# EAGLE design messverstaerker-opamp-proto (EAGLE 9.6.0)
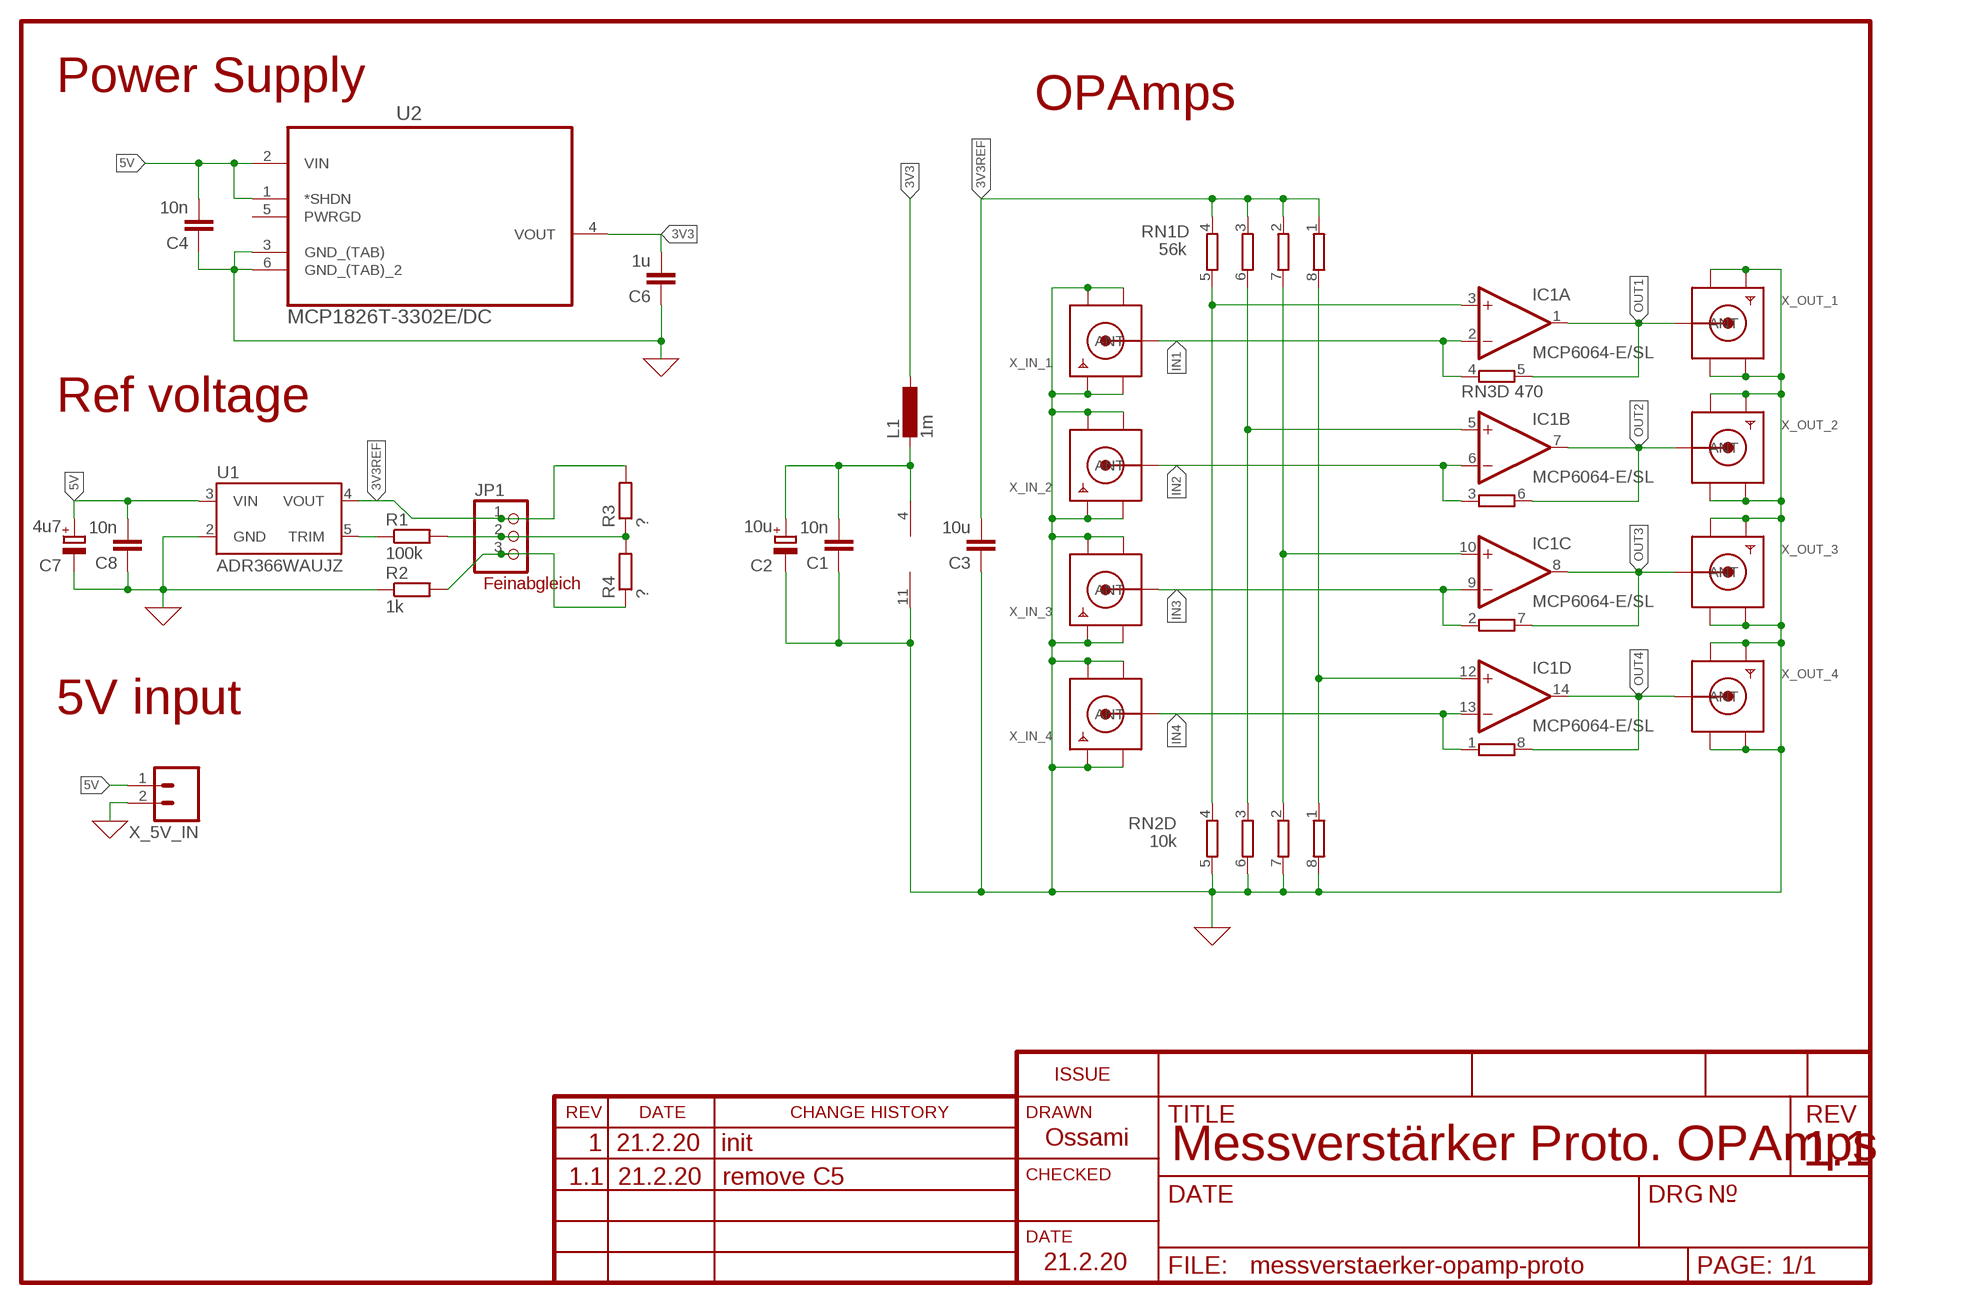
[diagram p0: schematic, sheet 1]

## Parts
C1  10n  C-EUC0805  [C0805]
C2  10u  CPOL-EU153CLV-0810  [153CLV-0810]
C3  10u  C-EUC0805  [C0805]
C4  10n  C-EUC0805  [C0805]
C6  1u  C-EUC0805  [C0805]
C7  4u7  CPOL-EU153CLV-0810  [153CLV-0810]
C8  10n  C-EUC0805  [C0805]
IC1  MCP6064-E/SL  MCP604SL  [SO14]
JP1  PINHD-1X3  [1X03]
L1  1m  L-EUL5650M  [L5650M]
R1  100k  R-EU_R0805  [R0805]
R2  1k  R-EU_R0805  [R0805]
R3  ?  R-EU_R0805  [R0805]
R4  ?  R-EU_R0805  [R0805]
RN1  56k  4R-NEXBS8V  [EXBS8V]
RN2  10k  4R-NEXBS8V  [EXBS8V]
RN3  470  4R-NEXBS8V  [EXBS8V]
U1  ADR366WAUJZ  ADR36_UJZ  [SOT23-5]
U2  MCP1826T-3302E/DC  MCP1826T-3002E/DC  [SOT230P700X180-6N]
X_5V_IN  M02LOCK  [1X02_LOCK]
X_IN_1  SMACONNECTOR_EDGE  [SMA_EDGELAUNCH]
X_IN_2  SMACONNECTOR_EDGE  [SMA_EDGELAUNCH]
X_IN_3  SMACONNECTOR_EDGE  [SMA_EDGELAUNCH]
X_IN_4  SMACONNECTOR_EDGE  [SMA_EDGELAUNCH]
X_OUT_1  SMACONNECTOR_EDGE  [SMA_EDGELAUNCH]
X_OUT_2  SMACONNECTOR_EDGE  [SMA_EDGELAUNCH]
X_OUT_3  SMACONNECTOR_EDGE  [SMA_EDGELAUNCH]
X_OUT_4  SMACONNECTOR_EDGE  [SMA_EDGELAUNCH]

## Nets
0: C1.1 C2.- C3.1 C4.1 C6.1 C7.- C8.1 IC1.11(P:V-) R2.1 RN2.5 RN2.6 RN2.7 RN2.8 U1.2(GND) U2.3(GND_(TAB)) U2.6(GND_(TAB)_2) X_5V_IN.2 X_IN_1.GND@1(GND4) X_IN_1.GND@2(GND3) X_IN_1.GND@3(GND2) X_IN_1.GND@4(GND1) X_IN_2.GND@1(GND4) X_IN_2.GND@2(GND3) X_IN_2.GND@3(GND2) X_IN_2.GND@4(GND1) X_IN_3.GND@1(GND4) X_IN_3.GND@2(GND3) X_IN_3.GND@3(GND2) X_IN_3.GND@4(GND1) X_IN_4.GND@1(GND4) X_IN_4.GND@2(GND3) X_IN_4.GND@3(GND2) X_IN_4.GND@4(GND1) X_OUT_1.GND@1(GND4) X_OUT_1.GND@2(GND3) X_OUT_1.GND@3(GND2) X_OUT_1.GND@4(GND1) X_OUT_2.GND@1(GND4) X_OUT_2.GND@2(GND3) X_OUT_2.GND@3(GND2) X_OUT_2.GND@4(GND1) X_OUT_3.GND@1(GND4) X_OUT_3.GND@2(GND3) X_OUT_3.GND@3(GND2) X_OUT_3.GND@4(GND1) X_OUT_4.GND@1(GND4) X_OUT_4.GND@2(GND3) X_OUT_4.GND@3(GND2) X_OUT_4.GND@4(GND1) ; supply symbol labelled GND
3V3: C6.2 L1.1 U2.4(VOUT)
3V3REF: C3.2 JP1.1 R3.2 RN1.1 RN1.2 RN1.3 RN1.4 U1.4(VOUT)
5V: C4.2 C7.+ C8.2 U1.3(VIN) U2.1(*SHDN) U2.2(VIN) X_5V_IN.1
IN1: IC1.2(A:-IN) RN3.4 X_IN_1.P(ANT)
IN2: IC1.6(B:-IN) RN3.3 X_IN_2.P(ANT)
IN3: IC1.9(C:-IN) RN3.2 X_IN_3.P(ANT)
IN4: IC1.13(D:-IN) RN3.1 X_IN_4.P(ANT)
N$1: IC1.3(A:+IN) RN1.5 RN2.4
N$2: IC1.5(B:+IN) RN1.6 RN2.3
N$3: IC1.10(C:+IN) RN1.7 RN2.2
N$4: IC1.12(D:+IN) RN1.8 RN2.1
N$5: R1.1 U1.5(TRIM)
N$6: C1.2 C2.+ IC1.4(P:V+) L1.2
N$8: JP1.2 R1.2 R3.1 R4.2
N$10: JP1.3 R2.2 R4.1
OUT1: IC1.1(A:OUT) RN3.5 X_OUT_1.P(ANT)
OUT2: IC1.7(B:OUT) RN3.6 X_OUT_2.P(ANT)
OUT3: IC1.8(C:OUT) RN3.7 X_OUT_3.P(ANT)
OUT4: IC1.14(D:OUT) RN3.8 X_OUT_4.P(ANT)
Unconnected: U2.5(PWRGD)

## Notes on the sheet
- Power Supply
- OPAmps
- Ref voltage
- Feinabgleich
- 5V input
- 1  21.2.20   init | Ossami
- Messverstärker Proto. OPAmps | 1.1
- 1.1  21.2.20   remove C5
- 21.2.20

## Library data of the parts
C1 C3 C4 C6 C8 = rcl:C-EU: CAPACITOR, European symbol; SPICEPREFIX: C
C2 C7 = rcl:CPOL-EU: POLARIZED CAPACITOR, European symbol; SPICEPREFIX: C
IC1 = linear:MCP604: Quad Op Amp 2.7V to 6.0V Single Supply CMOS Source: http://ww1.microchip.com/downloads/en/DeviceDoc/21314g.pdf
JP1 = adafruit:PINHD-1X3: PIN HEADER
L1 = rcl:L-EU: INDUCTOR, European symbol; SPICEPREFIX: L
R1-R4 = rcl:R-EU_: RESISTOR, European symbol; SPICEPREFIX: R
RN1-RN3 = resistor-dil:4R-N: Array Chip Resistor Source: RS Component / Phycomp; OC_FARNELL: unknown; OC_NEWARK: unknown
U1 = ADR360:ADR36*: ADR360 (ADR360 ADR361 ADR363 ADR364 ADR365 ADR366 A|B UJZ) 5-Lead TSOT Low Power, Low Noise, Band Gap Voltage References Analog Devices Source: www.analog.com Technologies / Packages ADR36n A|B UJZ n Output-Voltage: 0 = 2.048V | 1 = 2.500 V | 3 = 3.000 V | 4 = 4.096 V | 5 = 5.000 V | 6 = 3.300 V A|B Grade: A = 25 ppm/K; +-6 mV max. | B = 9 ppm/K; +- 3mV max. UJZ Package: 5-Lead TSOT, RoHS-compliant Vin = 15 (18) V, Vdrop = 300 mV, Iout = +5 mA / -1mA Author: Dipl.-Ing. FH Rainer Bayer HHN Hochschule Heilbronn, rainer.bayer@hs-heilbronn.de Ingenieurbüro ing-rb, mail@ing-rb.de
U2 = MCP1826T-3002E_DC:MCP1826T-3002E/DC: IC, LDO VOLT REG, 3V, 1A; AVAILABILITY: Good; DESCRIPTION: Ic, Linear Regulator; Max. Input, 6v; Output, 3v; 1000ma; Accuracy, 0.5%; Sot223-5; MF: Microchip; MP: MCP1826T-3002E/DC; PACKAGE: SOT-223 Microchip; PRICE: 0.59 USD
X_5V_IN = aSparkFun:M02: Header 2 Standard 2-pin 0.1" header. Use with straight break away headers (SKU : PRT-00116), right angle break away headers (PRT-00553), swiss pins (PRT-00743), machine pins (PRT-00117), and female headers (PRT-00115). Molex polarized connector foot print use with SKU : PRT-08233 with associated crimp pins and housings.
X_IN_1-X_IN_4 X_OUT_1-X_OUT_4 = adafruit:SMACONNECTOR: SMA Connector 90° DIP SMA Connector, 50 Ohm (4UConnector: 07259)

## Board
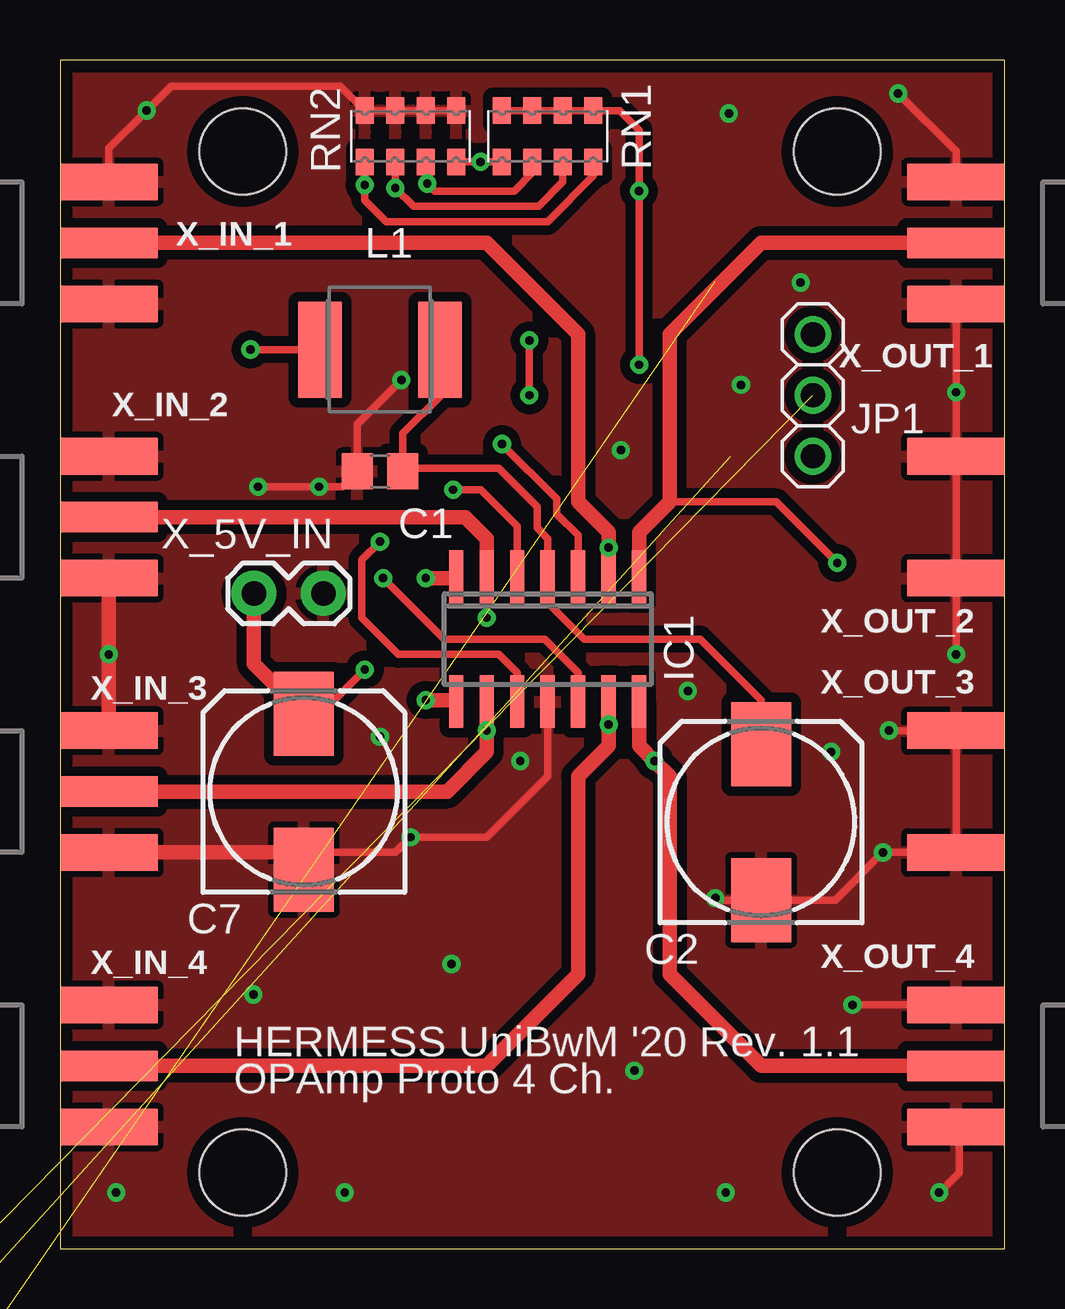
[diagram p1: board, top side]
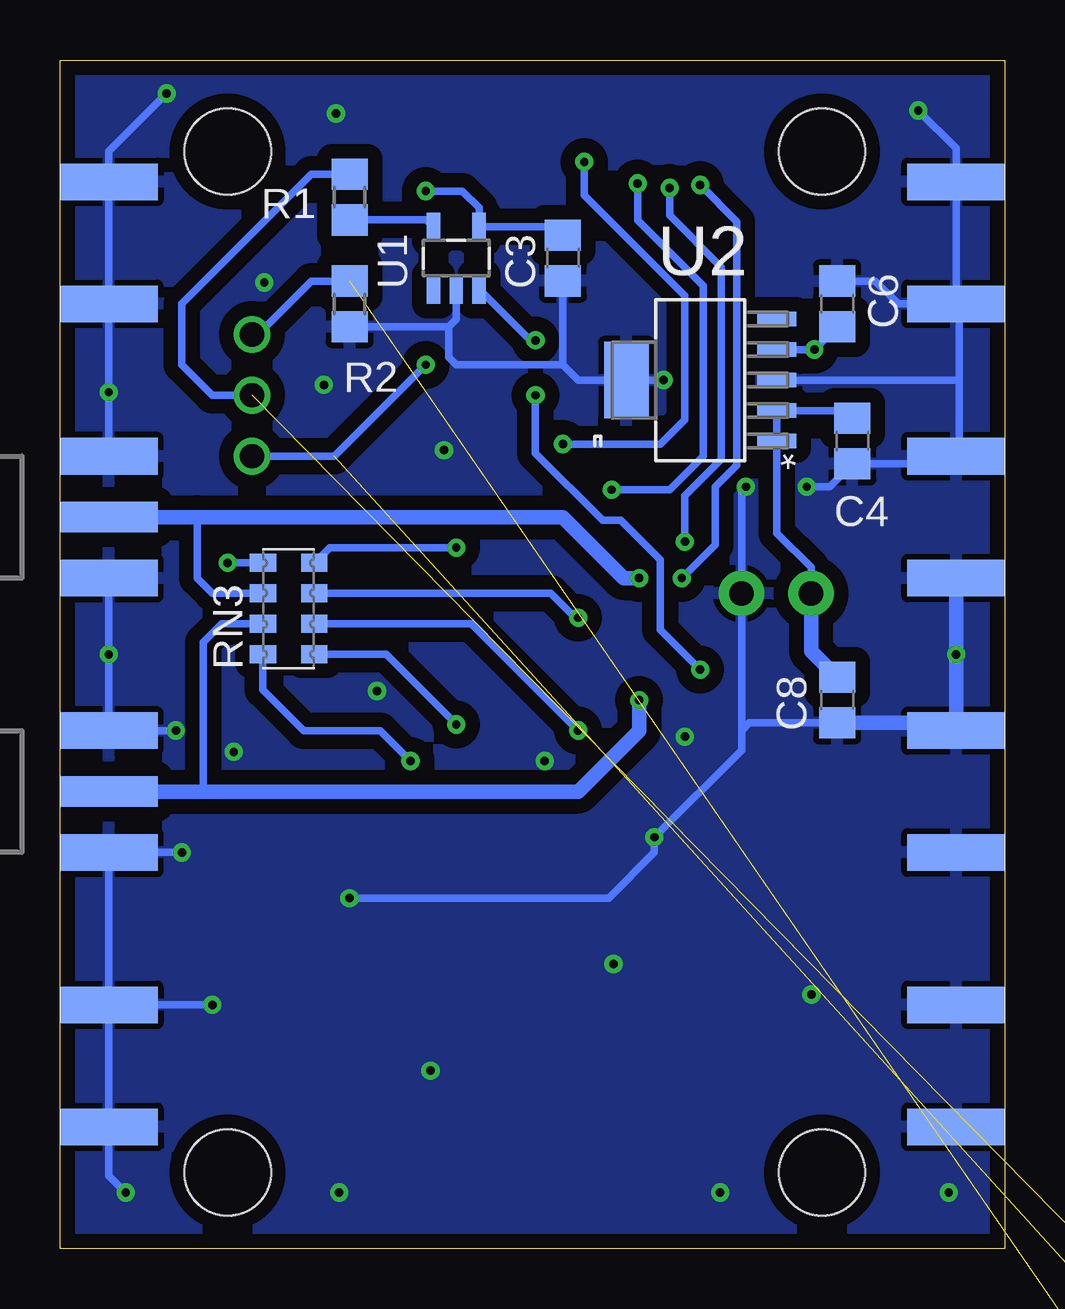
[diagram p2: board, bottom side, seen from below]

Size 39.37 x 49.53 mm. Coordinates in mm from the lower left corner, seen from the top.
Outline: 0,0 39.37,0 39.37,49.53 0,49.53 0,0
Copper layers (1*16): Top 0.035mm / dielectric 1.5mm / Bottom 0.035mm
Design rules "default *": minimum track width 12mil, minimum drill 0.35mm, track to track 12mil, track to pad 12mil, pad to pad 12mil, via to via 12mil, smd to smd 6mil, copper to edge 20mil, drill to drill 6mil, minimum pad ring 10mil, minimum via ring 8mil, stop-mask expansion 4mil, vias tented up to drill 0mil, thermal gap 10mil
Holes 3.6 mm at 32.38,45.72 7.62,45.72 7.62,3.18 32.38,3.18

### Footprints (pad centres in the part's own frame; a part is rotated, then mirrored left to right if it is on the bottom)
C0805 = smd 1.3 x 1.5: 1 -0.95,0; 2 0.95,0
153CLV-0810 = smd 3.5 x 2.5: + 3.25,0; - -3.25,0
SO14 = smd 0.6 x 2.2: 1 -3.81,-2.6; 2 -2.54,-2.6; 3 -1.27,-2.6; 4 0,-2.6; 5 1.27,-2.6; 6 2.54,-2.6; 7 3.81,-2.6; 8 3.81,2.6; 9 2.54,2.6; 10 1.27,2.6; 11 0,2.6; 12 -1.27,2.6; 13 -2.54,2.6; 14 -3.81,2.6
1X03 = drill 1.016: 1 -2.54,0; 2 0,0; 3 2.54,0
L5650M = smd 1.8 x 4: 1 -2.5,0; 2 2.5,0
R0805 = smd 1.3 x 1.5: 1 -0.95,0; 2 0.95,0
EXBS8V = smd 0.75 x 1.1: 1 -1.905,-1.07; 2 -0.635,-1.07; 3 0.635,-1.07; 4 1.905,-1.07; 5 1.905,1.07; 6 0.635,1.07; 7 -0.635,1.07; 8 -1.905,1.07
SOT23-5 = smd 0.55 x 1.2: 1 -0.95,-1.3; 2 0,-1.3; 3 0.95,-1.3; 4 0.95,1.3; 5 -0.95,1.3
SOT230P700X180-6N = smd 1.626 x 0.61: 1 -3.2,2.54; 2 -3.2,1.27; 3 -3.2,0; 4 -3.2,-1.27; 5 -3.2,-2.54 | smd 1.854 x 3.175: 6 3.073,0
1X02_LOCK = drill 1.016 pad 1.88: 1 -0.178,0; 2 2.718,0
SMA_EDGELAUNCH = smd 4.064 x 1.524: GND@1 2.032,-2.54; GND@2 2.032,2.54 | smd 4.064 x 1.524 bottom: GND@3 2.032,2.54; GND@4 2.032,-2.54 | smd 4.064 x 1.27: P 2.032,0

### Placement (x,y rotation side)
C1  13.34,32.39 0 top
C2  29.21,17.78 90 top
C3  18.41,41.28 90 bottom
C4  6.35,33.66 90 bottom
C6  6.99,39.37 270 bottom
C7  10.16,19.05 90 top
C8  6.99,22.86 90 bottom
IC1  20.32,25.4 180 top
JP1  31.37,35.56 90 top
L1  13.34,37.47 0 top
R1  27.3,43.81 90 bottom
R2  27.3,39.37 90 bottom
R3  -6.99,-4.45 0 top  (outside the outline)
R4  -6.99,-10.79 0 top  (outside the outline)
RN1  20.32,46.36 180 top
RN2  14.61,46.36 0 top
RN3  29.84,26.67 90 bottom
U1  22.86,41.28 0 bottom
U2  12.7,36.19 180 bottom
X_5V_IN  8.26,27.31 0 top
X_IN_1  0,41.91 0 top
X_IN_2  0,30.48 0 top
X_IN_3  0,19.05 0 top
X_IN_4  0,7.62 0 top
X_OUT_1  39.37,41.91 180 top
X_OUT_2  39.37,30.48 0 bottom
X_OUT_3  39.37,19.05 0 bottom
X_OUT_4  39.37,7.62 180 top

### Tracks (layer width: path | path; a pad name or v marks a point on that pad's centre or on a via)
0  (via drill 0.35)
  Top 0.305: v8.26,31.75 v10.79,31.75 11.75,31.75 C1.1 12.38,34.36 v14.22,36.19 | RN2.5 RN2.6 RN2.7 RN2.8 11.68,48.44 4.63,48.44 v3.61,47.42 2.03,45.85 X_IN_1.GND@2 | IC1.11 20.32,19.68 17.78,17.14 v14.61,17.14 13.97,16.51 10.87,16.51 C7.- | v27.3,14.61 27.38,14.53 C2.- 32.31,14.53 v34.29,16.51 X_OUT_3.GND@1 X_OUT_3.GND@2 v34.54,21.59 | X_OUT_4.GND@4 v33.02,10.16 | v37.34,24.76 X_OUT_2.GND@1 X_OUT_2.GND@2 v37.34,35.69 X_OUT_1.GND@2 | X_OUT_1.GND@1 37.34,45.72 v34.92,48.13 v34.92,48.14 | v36.63,2.34 37.47,3.18 37.47,4.95 X_OUT_4.GND@3
  Top 0.61: C7.- 9.45,16.51 X_IN_3.GND@1 | X_IN_2.GND@4 v2.03,24.76 X_IN_3.GND@2
  Bottom 0.305: U1.2 22.86,38.73 23.18,38.42 | 23.18,38.42 R2.1 | C3.1 18.41,36.83 | 18.41,36.83 17.78,36.19 U2.6 v14.22,36.19 | 18.41,36.83 22.86,36.83 23.18,37.14 23.18,38.42 | C6.1 5.39,40.32 4.45,39.37 X_IN_1.GND@1 | v8.26,31.75 7.3,31.75 C4.1 2.35,32.7 X_IN_2.GND@3 1.91,33.15 1.91,36.19 | 1.91,36.19 1.91,39.24 X_IN_1.GND@1 | U2.3 1.91,36.19 | X_IN_1.GND@1 X_IN_1.GND@2 2.03,45.85 v3.61,47.42 | 10.97,21.59 X_5V_IN.2 10.97,31.57 v10.79,31.75 | 10.97,21.59 10.97,20.78 v14.61,17.14 14.61,16.51 16.51,14.61 v27.3,14.61 | X_OUT_2.GND@2 v37.34,35.69 X_OUT_1.GND@2 X_OUT_1.GND@1 37.34,45.72 v34.92,48.14 | X_OUT_2.GND@1 v37.34,24.76 X_OUT_3.GND@2 v34.54,21.59 | X_OUT_4.GND@4 X_OUT_3.GND@1 v34.29,16.51 | X_OUT_4.GND@4 X_OUT_4.GND@3 37.34,3.05 v36.63,2.34 | v33.02,10.16 X_OUT_4.GND@4 | C8.1 10.65,21.91 10.97,21.59
  Bottom 0.61: C8.1 2.35,21.91 X_IN_3.GND@2 v2.03,24.76 X_IN_2.GND@4
  other vias: 30.86,40.26 26.16,23.24 19.18,20.32 32.13,20.7 23.37,33.27 13.34,21.34 27.87,47.3 28.38,36 8.05,10.59 16.31,11.86 23.93,7.42 2.34,2.34 27.74,2.34 11.87,2.34
  pour Bottom (isolate 0.61): -0.64,-0.63 40.01,-0.63 40.01,50.17 -0.64,50.17
  pour Top (isolate 0.406): 40.01,-0.63 -0.64,-0.63 -0.64,50.17 40.01,50.17
3V3  (via drill 0.35)
  Top 0.305: L1.1 v7.94,37.47
  Bottom 0.305: C6.2 v7.94,37.47 U2.4
3V3REF  (via drill 0.35)  (1 unrouted)
  Top 0.305: RN1.4 RN1.3 RN1.2 RN1.1 23.31,47.42 24.13,46.61 v24.13,44.07 v24.13,36.83
  Bottom 0.305: C3.2 18.77,42.58 U1.4 21.91,43.37 22.61,44.07 v24.13,44.07 | JP1.1 27.94,33.02 v24.13,36.83
5V  (via drill 0.35)
  Top 0.305: v19.56,37.85 v19.56,35.56 | C7.+ 10.87,22.3 v12.7,24.13
  Top 0.61: C7.+ 8.08,24.38 X_5V_IN.1
  Bottom 0.305: C4.2 6.67,34.92 U2.2 U2.1 9.5,29.82 8.08,28.4 X_5V_IN.1 | U1.3 19.78,37.85 v19.56,37.85 | v12.7,24.13 14.35,25.78 14.35,28.7 16,30.35 16.76,30.35 19.56,33.15 v19.56,35.56
  Bottom 0.61: C8.2 8.08,24.9 X_5V_IN.1
IN1  (via drill 0.35)
  Top 0.61: X_IN_1.P 17.78,41.91 21.59,38.1 21.59,31.11 22.86,29.85 v22.86,29.21 IC1.2
  Bottom 0.305: RN3.4 28.14,29.21 v22.86,29.21
IN2  (via drill 0.35)
  Top 0.305: v17.78,26.29 IC1.6
  Top 0.61: IC1.6 17.78,29.59 16.89,30.48 X_IN_2.P
  Bottom 0.305: RN3.3 18.92,27.31 17.91,26.29 v17.78,26.29
IN3  (via drill 0.35)
  Top 0.61: X_IN_3.P 16.13,19.05 17.78,20.7 v17.78,21.59 IC1.9
  Bottom 0.305: RN3.2 22.23,26.04 v17.78,21.59
IN4  (via drill 0.35)
  Top 0.61: X_IN_4.P 17.78,7.62 21.59,11.43 21.59,19.68 22.86,20.95 v22.86,21.84 IC1.13
  Bottom 0.305: RN3.1 25.78,24.76 v22.86,21.84
N$1  (via drill 0.35)
  Top 0.305: RN2.4 v17.53,45.28 RN1.5 | v18.41,33.53 20.7,31.24 20.7,30.61 21.59,29.72 IC1.3
  Bottom 0.305: v17.53,45.28 17.53,43.89 13.34,39.7 13.34,34.54 14.35,33.53 v18.41,33.53
N$2  (via drill 0.35)
  Top 0.305: RN1.6 19.68,44.83 18.92,44.07 15.62,44.07 v15.3,44.39 15.24,44.45 RN2.3 | IC1.5 19.05,30.1 17.53,31.62 v16.38,31.62
  Bottom 0.305: v15.3,44.39 15.3,42.86 12.57,40.13 12.57,33.02 13.97,31.62 v16.38,31.62
N$3  (via drill 0.35)
  Top 0.305: RN1.7 20.95,44.45 19.94,43.43 14.73,43.43 v13.97,44.2 RN2.2 | IC1.10 19.05,24 18.29,24.76 14.1,24.76 12.57,26.29 12.57,28.7 v13.34,29.46
  Bottom 0.305: v13.97,44.2 13.97,43.05 11.81,40.89 11.81,32.89 13.34,31.37 v13.34,29.46
N$4  (via drill 0.35)
  Top 0.305: RN1.8 22.23,44.7 20.32,42.8 13.59,42.8 12.7,43.69 v12.7,44.32 RN2.1 | IC1.12 21.59,24 20.19,25.4 16,25.4 v13.46,27.94
  Bottom 0.305: v12.7,44.32 11.18,42.8 11.18,32.64 12.06,31.75 12.06,29.34 v13.46,27.94
N$5
  Bottom 0.305: U1.5 24.1,42.86 R1.1
N$6
  Top 0.305: L1.2 15.84,35.52 14.29,33.97 C1.2 14.41,32.51 18.29,32.51 19.88,30.92 19.88,30.04 20.32,29.59 IC1.4 20.32,26.92 21.84,25.4 26.67,25.4 29.21,22.86 C2.+
N$8  (2 unrouted)
  Bottom 0.305: R1.2 28.89,44.77 34.29,39.37 34.29,36.83 33.02,35.56 JP1.2
N$10  (1 unrouted)
  Bottom 0.305: JP1.3 31.11,38.1 28.89,40.32 R2.2
OUT1  (via drill 0.35)
  Top 0.305: v32.38,28.57 29.84,31.11 25.4,31.11
  Top 0.61: IC1.1 24.13,29.85 25.4,31.11 25.4,38.1 29.21,41.91 X_OUT_1.P
  Bottom 0.305: RN3.5 v32.38,28.57
OUT2  (via drill 0.35)
  Top 0.61: v15.24,27.94 16.45,27.94 IC1.7
  Bottom 0.305: RN3.6 33.02,27.31 33.66,27.94 33.66,30.48
  Bottom 0.61: X_OUT_2.P 33.66,30.48 18.41,30.48 15.88,27.94 v15.24,27.94
OUT3  (via drill 0.35)
  Top 0.61: v15.24,22.86 16.45,22.86 IC1.8
  Bottom 0.305: RN3.7 32.64,26.04 33.4,25.27 33.4,19.05
  Bottom 0.61: X_OUT_3.P 33.4,19.05 17.78,19.05 15.24,21.59 v15.24,22.86
OUT4  (via drill 0.35)
  Top 0.61: IC1.14 24.13,20.95 v24.77,20.32 25.4,19.68 25.4,11.43 29.21,7.62 34.92,7.62 X_OUT_4.P
  Bottom 0.305: RN3.8 30.91,23.29 29.21,21.59 26.04,21.59 v24.77,20.32

### Text on the board
tNames: HERMESS UniBwM '20 Rev. 1.1 / OPAmp Proto 4 Ch.